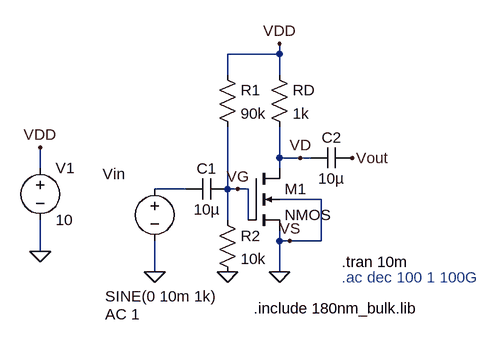
[diagram p0: schematic CS_Amplifier_Analysis.asc]
CS_Amplifier_Analysis.asc, the LTspice schematic file:
Version 4
SHEET 1 880 680
WIRE 240 -80 240 -96
WIRE 240 -80 160 -80
WIRE 160 -48 160 -80
WIRE 240 -48 240 -80
WIRE 240 80 240 32
WIRE 272 80 240 80
WIRE 288 80 272 80
WIRE -128 96 -128 64
WIRE 240 96 240 80
WIRE 96 128 48 128
WIRE 160 128 160 32
WIRE 176 128 160 128
WIRE 192 128 176 128
WIRE 304 144 240 144
WIRE 160 176 160 128
WIRE 192 176 192 128
WIRE 240 208 240 192
WIRE 256 208 240 208
WIRE 304 208 304 144
WIRE 304 208 256 208
WIRE -128 224 -128 176
WIRE 48 256 48 208
WIRE 240 256 240 208
FLAG 240 256 0
FLAG 48 256 0
FLAG -128 224 0
FLAG -128 64 VDD
FLAG 240 -96 VDD
FLAG 352 80 Vout
FLAG 160 256 0
FLAG 272 80 VD
FLAG 256 208 VS
FLAG 176 128 VG
SYMBOL voltage -128 80 R0
WINDOW 123 0 0 Left 0
WINDOW 39 0 0 Left 0
SYMATTR InstName V1
SYMATTR Value 10
SYMBOL voltage 48 112 R0
WINDOW 0 -80 -7 Left 2
WINDOW 3 -76 181 Left 2
WINDOW 123 -76 209 Left 2
WINDOW 39 0 0 Left 0
SYMATTR InstName Vin
SYMATTR Value SINE(0 10m 1k)
SYMATTR Value2 AC 1
SYMBOL res 224 -64 R0
SYMATTR InstName RD
SYMATTR Value 1k
SYMBOL cap 352 64 R90
WINDOW 0 0 32 VBottom 2
WINDOW 3 32 32 VTop 2
SYMATTR InstName C2
SYMATTR Value 10µ
SYMBOL cmosn 192 96 R0
SYMATTR InstName M1
SYMATTR Value NMOS
SYMATTR Value2 l=0.18u w=5u
SYMBOL cap 96 144 R270
WINDOW 0 32 32 VTop 2
WINDOW 3 0 32 VBottom 2
SYMATTR InstName C1
SYMATTR Value 10µ
SYMBOL res 144 -64 R0
SYMATTR InstName R1
SYMATTR Value 90k
SYMBOL res 144 160 R0
SYMATTR InstName R2
SYMATTR Value 10k
TEXT 336 240 Left 2 !.tran 10m
TEXT 200 312 Left 2 !.include 180nm_bulk.lib
TEXT 336 264 Left 2 ;.ac dec 100 1 100G

The netlist it stands for:
* CS_Amplifier_Analysis.asc
V1 VDD 0 10
Vin N001 0 SINE(0 10m 1k) AC 1
RD VDD VD 1k
C2 Vout VD 10µ
M1 VD VG 0 0 NMOS l=0.18u w=5u
C1 N001 VG 10µ
R1 VDD VG 90k
R2 VG 0 10k
.model NMOS NMOS
.model PMOS PMOS
.lib standard.mos
.tran 10m
.include 180nm_bulk.lib
* .ac dec 100 1 100G
.backanno
.end